# EAGLE design 25062016wearable_v1.2 - routed 99% (EAGLE 7.6.0)
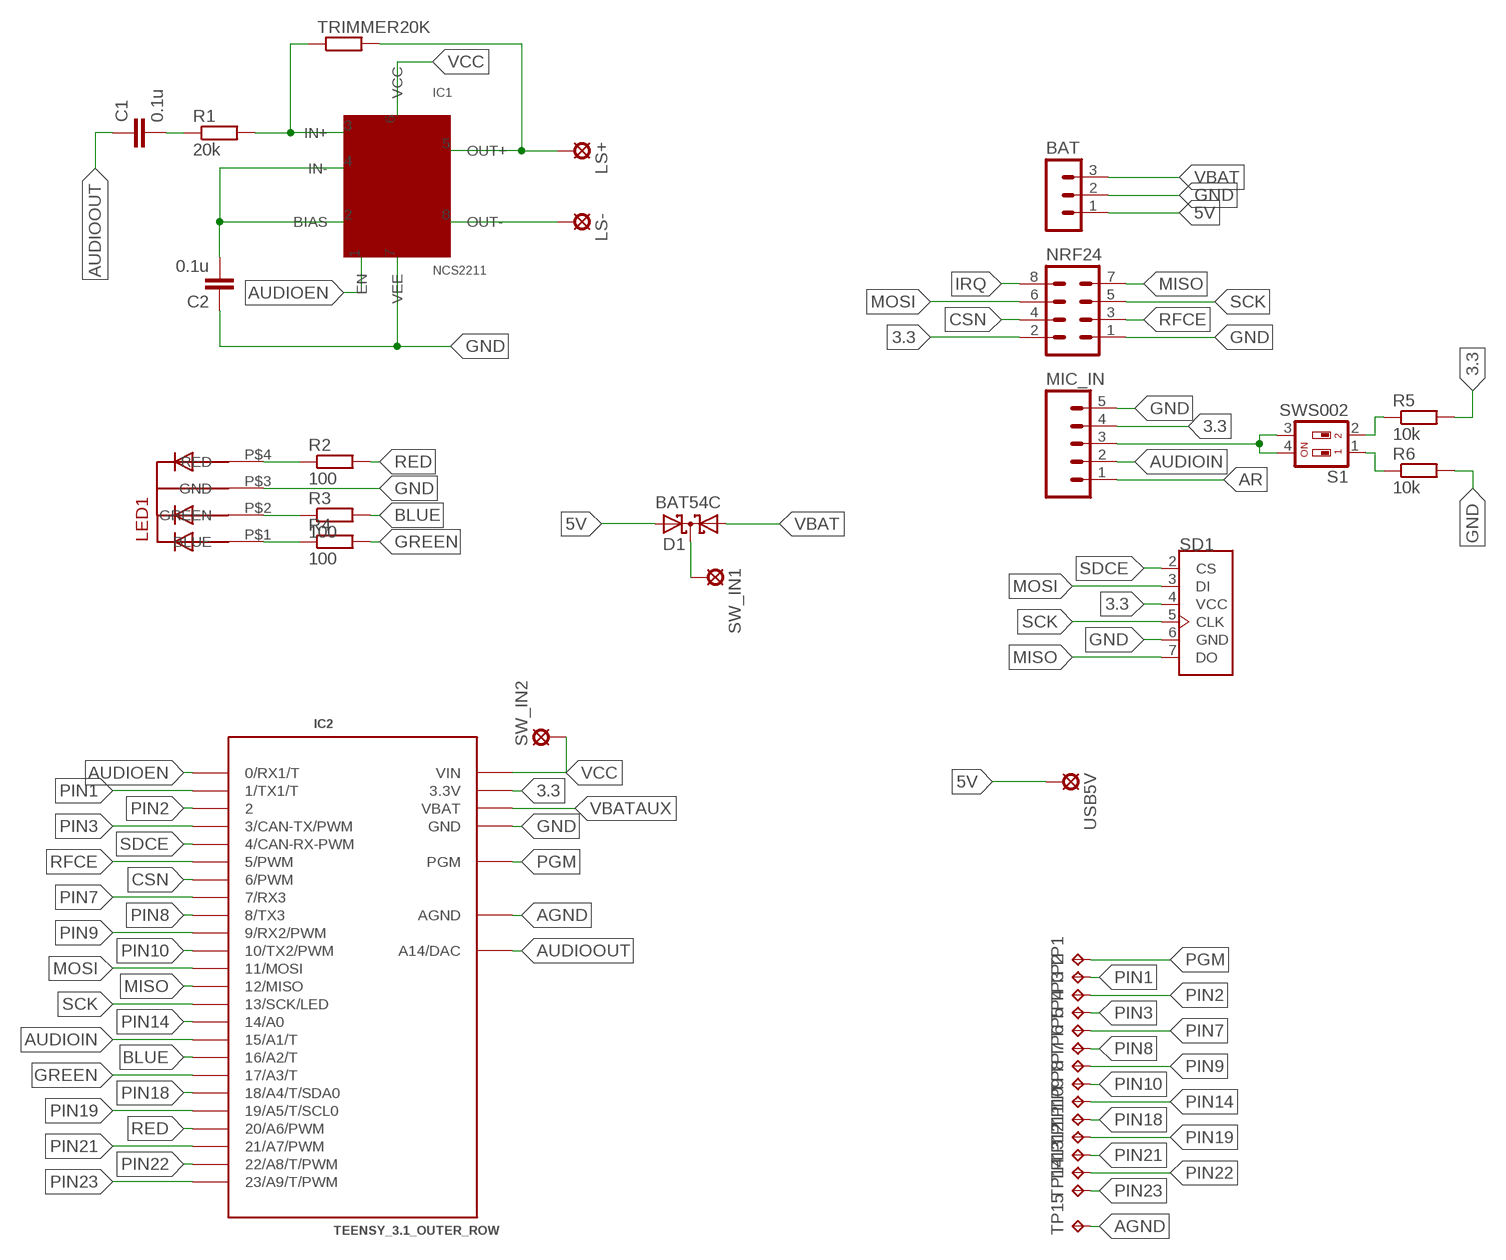
[diagram p0: schematic, sheet 1]

## Parts
BAT  MA03-1  [MA03-1]
C1  0.1u  C2.5/2  [C2.5-2]
C2  0.1u  C2.5/2  [C2.5-2]
D1  BAT54C  [SOT23]
IC1  NCS2211  [SOIC-8]
IC2  TEENSY_3.1_OUTER_ROW  [TEENSY3-OUTER_ROW]
LED1  5MMRGBLED  [LED5MMRGB]
LS+  LSP10  [LSP10]
LS-  LSP10  [LSP10]
MIC_IN  MA05  [05PA]
NRF24  MA04-2  [MA04-2]
R1  20k  R-EU_0204/7  [0204/7]
R2  100  R-EU_0207/2V  [0207/2V]
R3  100  R-EU_0207/2V  [0207/2V]
R4  100  R-EU_0207/2V  [0207/2V]
R5  10k  R-EU_0207/2V  [0207/2V]
R6  10k  R-EU_0207/2V  [0207/2V]
S1  SWS002  [SMS-002]
SD1  MICROSD_SF-MICROSD  [MICROSD_MICROSD]
SW_IN1  SE11  [SE11]
SW_IN2  SE11  [SE11]
TP1  TPPAD1-13  [P1-13]
TP2  TPPAD1-13  [P1-13]
TP3  TPPAD1-13  [P1-13]
TP4  TPPAD1-13  [P1-13]
TP5  TPPAD1-13  [P1-13]
TP6  TPPAD1-13  [P1-13]
TP7  TPPAD1-13  [P1-13]
TP8  TPPAD1-13  [P1-13]
TP9  TPPAD1-13  [P1-13]
TP10  TPPAD1-13  [P1-13]
TP11  TPPAD1-13  [P1-13]
TP12  TPPAD1-13  [P1-13]
TP13  TPPAD1-13  [P1-13]
TP14  TPPAD1-13  [P1-13]
TP15  TPPAD1-13  [P1-13]
TRIMMER20K  R-EU_0207/2V  [0207/2V]
USB5V  LSP10  [LSP10]

## Nets
3.3 [3.3]: IC2.3.3V IC2.3.3V1(3.3V) MIC_IN.4 NRF24.2 R5.2 SD1.4(VCC)
5V [3.3]: BAT.1 D1.2(A2) USB5V.MP
AGND: IC2.AGND TP15.TP
AR: MIC_IN.1
AUDIOEN: IC1.1(EN) IC2.0(0/RX1/T)
AUDIOIN: IC2.15/A1(15/A1/T) MIC_IN.2
AUDIOOUT: C1.1 IC2.RESET/DAC(A14/DAC)
BLUE: IC2.16/A2(16/A2/T) R3.2
CSN: IC2.6(6/PWM) NRF24.4
GAIN: MIC_IN.3 S1.3 S1.4
GND [GND]: BAT.2 C2.1 IC1.7(VEE) IC2.GND IC2.GND1(GND) LED1.P$3(GND) MIC_IN.5 NRF24.1 R6.2 SD1.6(GND)
GREEN: IC2.17/A3(17/A3/T) R4.2
IRQ: NRF24.8
MISO: IC2.12(12/MISO) NRF24.7 SD1.7(DO)
MOSI: IC2.11(11/MOSI) NRF24.6 SD1.3(DI)
N$1: D1.3(CC) SW_IN1.MP
N$2: IC1.5(OUT+) LS+.MP TRIMMER20K.2
N$3: IC1.3(IN+) R1.2 TRIMMER20K.1
N$4: C1.2 R1.1
N$5: C2.2 IC1.2(BIAS) IC1.4(IN-)
N$6: IC1.8(OUT-) LS-.MP
N$7: LED1.P$4(RED) R2.1
N$8: LED1.P$1(BLUE) R4.1
N$9: LED1.P$2(GREEN) R3.1
N$11: R5.1 S1.2
N$12: R6.1 S1.1
PGM: IC2.PGM TP1.TP
PIN1: IC2.1(1/TX1/T) TP2.TP
PIN2: IC2.2 TP3.TP
PIN3: IC2.3(3/CAN-TX/PWM) TP4.TP
PIN7: IC2.7(7/RX3) TP5.TP
PIN8: IC2.8(8/TX3) TP6.TP
PIN9: IC2.9(9/RX2/PWM) TP7.TP
PIN10: IC2.10(10/TX2/PWM) TP8.TP
PIN14: IC2.14/A0 TP9.TP
PIN18: IC2.18/A4(18/A4/T/SDA0) TP10.TP
PIN19: IC2.19/A5(19/A5/T/SCL0) TP11.TP
PIN21: IC2.21/A7(21/A7/PWM) TP12.TP
PIN22: IC2.22/A8(22/A8/T/PWM) TP13.TP
PIN23: IC2.23/A9(23/A9/T/PWM) TP14.TP
RED: IC2.20/A6(20/A6/PWM) R2.2
RFCE: IC2.5(5/PWM) NRF24.3
SCK: IC2.13(13/SCK/LED) NRF24.5 SD1.5(CLK)
SDCE: IC2.4(4/CAN-RX-PWM) SD1.2(CS)
VBAT [3.3]: BAT.3 D1.1(A1)
VBATAUX: IC2.VBAT
VCC: IC1.6(VCC) IC2.VIN SW_IN2.MP

## Library data of the parts
BAT = con-lstb:MA03-1: PIN HEADER; OC_FARNELL: unknown; OC_NEWARK: unknown
C1 C2 = capacitor-wima:C: CAPACITOR naming: grid - package width
D1 = diode:BAT54C: Schottky Diodes Source: Fairchild .. BAT54.pdf
IC1 = NCS2211:NCS2211
IC2 = Teensy_3_and_LC_Series_Boards_v1.1:TEENSY_3.1_OUTER_ROW: Footprint for Teensy 3.1 or 3.2 board using all pin connections on the outer perimeter
LED1 = led_rgb:5MMRGBLED
LS+ LS- USB5V = solpad:LSP10: SOLDER PAD drill 1.0 mm, distributor Buerklin, 12H555
MIC_IN = con-amp-quick:MA05: AMP QUICK CONNECTOR; OC_FARNELL: unknown; OC_NEWARK: unknown
NRF24 = con-lstb:MA04-2: PIN HEADER; OC_FARNELL: unknown; OC_NEWARK: unknown
R1-R6 TRIMMER20K = rcl:R-EU_: RESISTOR, European symbol
S1 = smd-special:SWS002: SMD Dip Switch 2 pol.
SD1 = sd:MICROSD_SF-MICROSD
SW_IN1 SW_IN2 = solpad:SE11: SOLDER PAD RTM, drill 1,1mm, distributor Buerklin, 07F810
TP1-TP15 = testpad:TP: Test pad

## Net classes
0 default: width 0.406 mm
1 GND: width 0.61 mm
2 3.3: width 0.61 mm

## Board
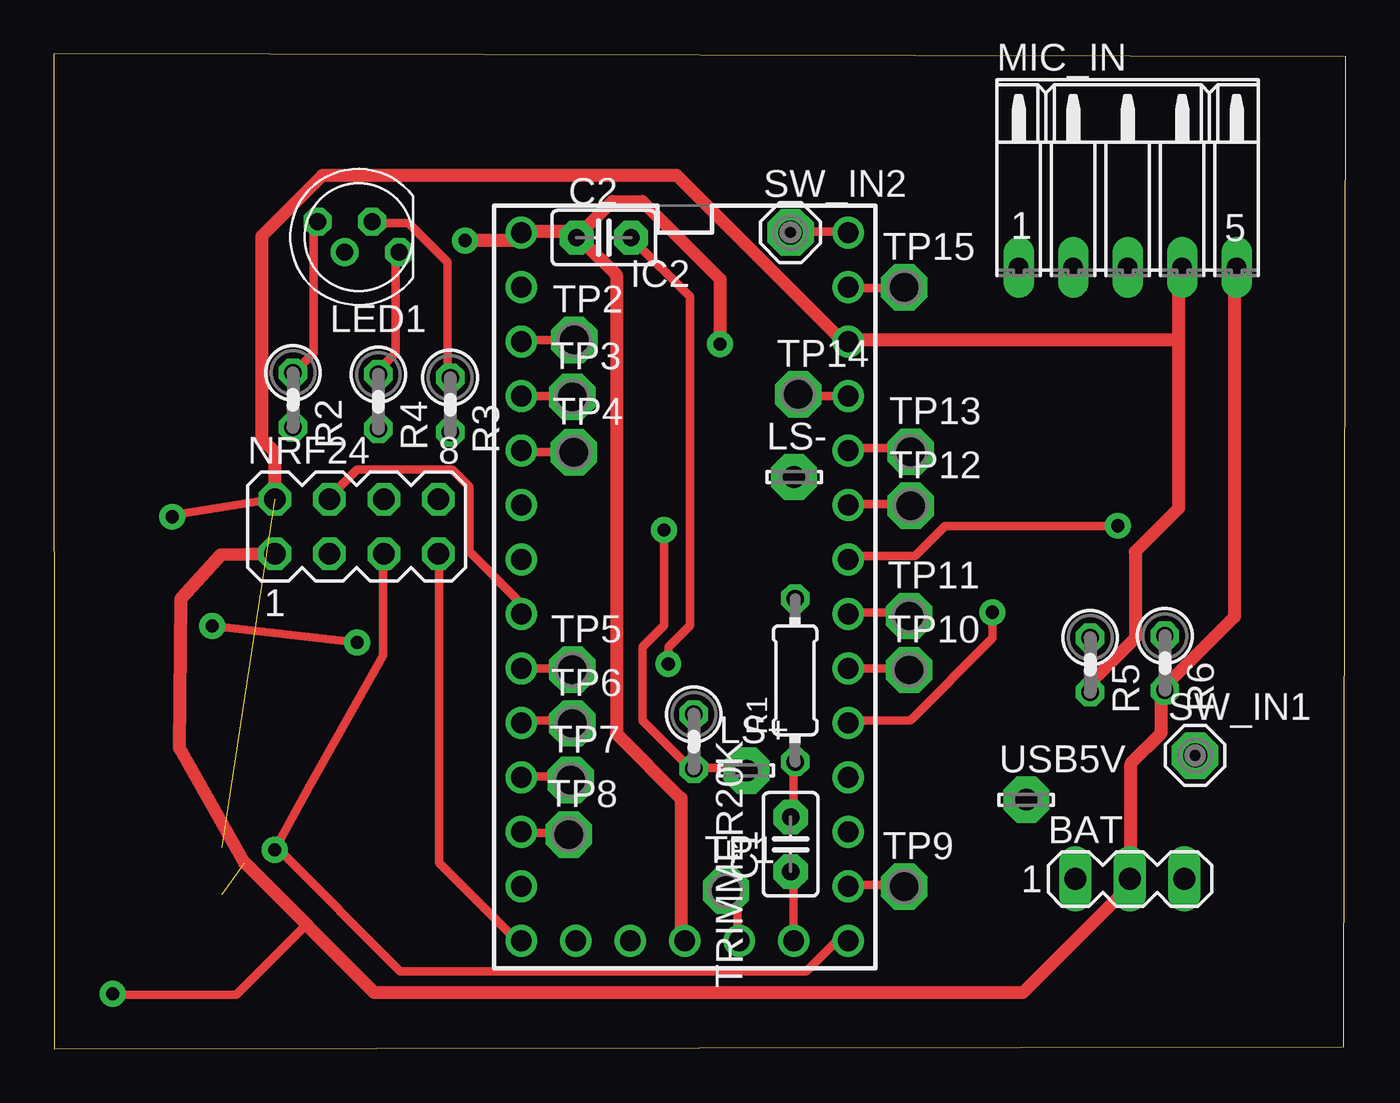
[diagram p1: board, top side]
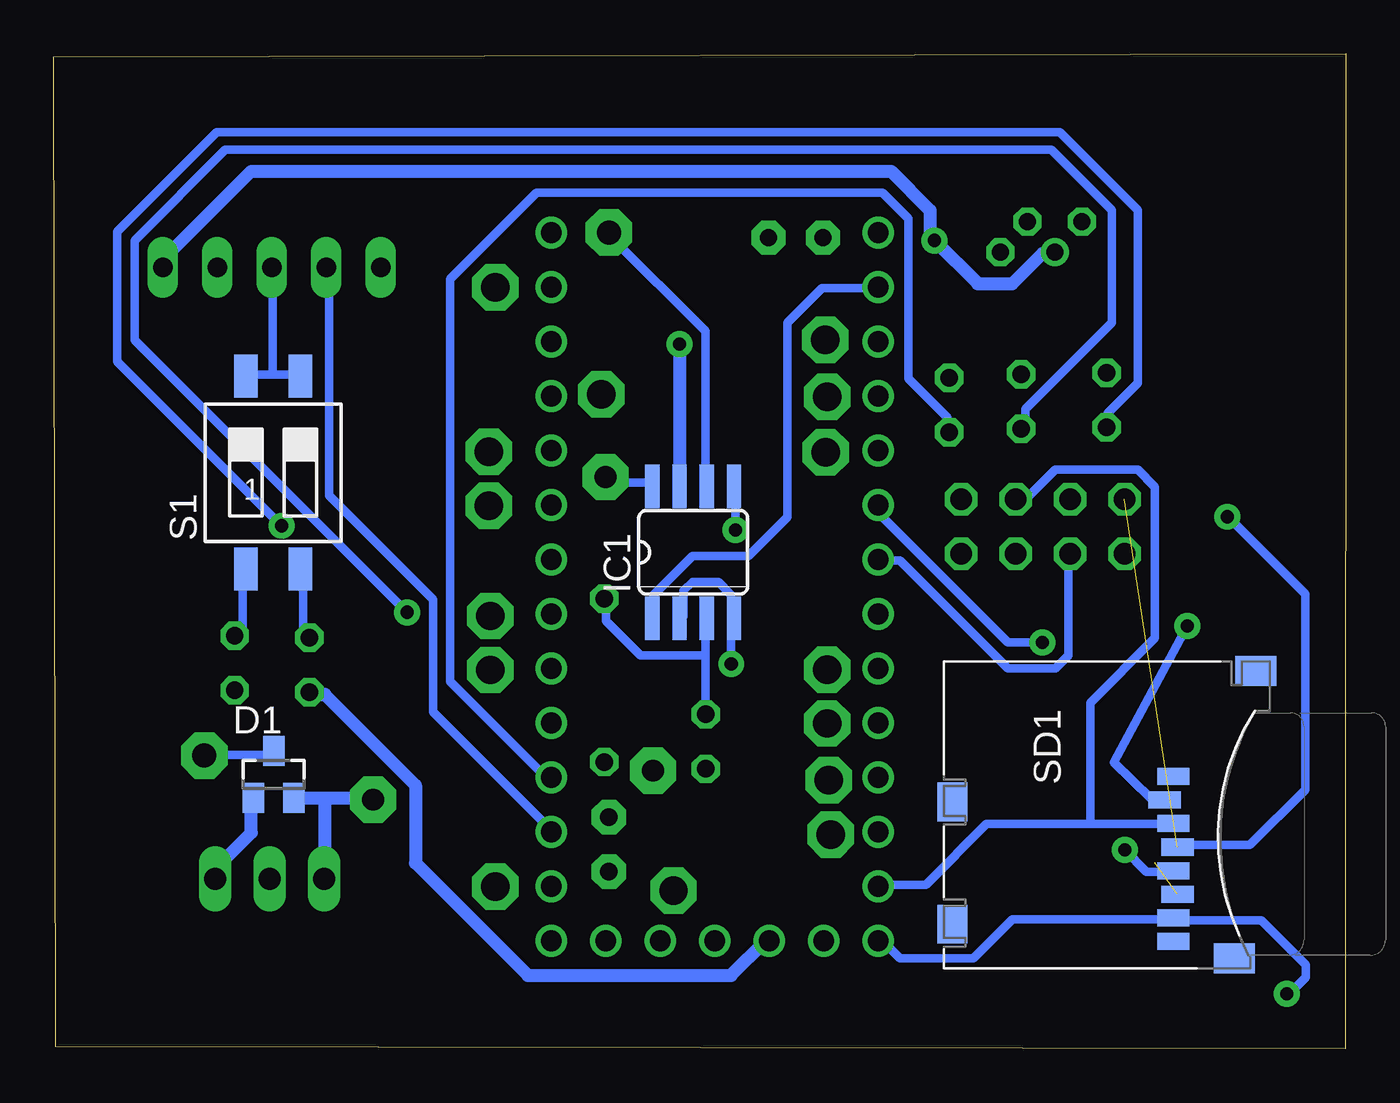
[diagram p2: board, bottom side, seen from below]

Size 60.25 x 46.41 mm. Coordinates in mm from the lower left corner, seen from the top.
Outline: 0.03,0 60.16,0.1 60.25,46.26 0,46.41 0.03,0
Copper layers (1*16): Top 0.035mm / dielectric 1.5mm / Bottom 0.035mm
Design rules "default *": minimum track width 10mil, minimum drill 24mil, track to track 0.4mm, track to pad 0.4mm, pad to pad 0.4mm, via to via 0.4mm, smd to smd 0.4mm, copper to edge 40mil, drill to drill 8mil, minimum pad ring 10mil, minimum via ring 0.3mm, stop-mask expansion 4mil, vias tented up to drill 0mil, thermal gap 10mil

### Footprints (pad centres in the part's own frame; a part is rotated, then mirrored left to right if it is on the bottom)
MA03-1 = drill 1.016 long: 1 -2.54,0; 2 0,0; 3 2.54,0
C2.5-2 = drill 0.813 pad 1.6 octagon: 1 -1.27,0; 2 1.27,0
SOT23 = smd 1 x 1.4: 1 -0.95,-1.1; 2 0.95,-1.1; 3 0,1.1
SOIC-8 = smd 0.66 x 2.032: 1 -1.905,-3.073; 2 -0.635,-3.073; 3 0.635,-3.073; 4 1.905,-3.073; 5 1.905,3.073; 6 0.635,3.073; 7 -0.635,3.073; 8 -1.905,3.073
TEENSY3-OUTER_ROW = drill 0.965: 0 -7.62,13.97; 1 -7.62,11.43; 2 -7.62,8.89; 3 -7.62,6.35; 3.3V 7.62,11.43; 3.3V1 -2.54,-16.51; 4 -7.62,3.81; 5 -7.62,1.27; 6 -7.62,-1.27; 7 -7.62,-3.81; 8 -7.62,-6.35; 9 -7.62,-8.89; 10 -7.62,-11.43; 11 -7.62,-13.97; 12 -7.62,-16.51; 13 7.62,-16.51; 14/A0 7.62,-13.97; 15/A1 7.62,-11.43; 16/A2 7.62,-8.89; 17/A3 7.62,-6.35; 18/A4 7.62,-3.81; 19/A5 7.62,-1.27; 20/A6 7.62,1.27; 21/A7 7.62,3.81; 22/A8 7.62,6.35; 23/A9 7.62,8.89; AGND 7.62,13.97; GND -7.62,16.51; GND1 0,-16.51; PGM 2.54,-16.51; RESET/DAC 5.08,-16.51; VBAT -5.08,-16.51; VIN 7.62,16.51
LED5MMRGB = drill 0.8 pad 0.813 octagon: P$1 -1.905,0.714; P$2 -0.635,-0.714; P$4 1.905,-0.714 | drill 0.8 pad 0.813: P$3 0.635,0.714
LSP10 = drill 1.016 pad 2.159 octagon: MP 0,0
05PA = drill 0.914 long: 1 -5.08,0; 2 -2.54,0; 3 0,0; 4 2.54,0; 5 5.08,0
MA04-2 = drill 1.016 octagon: 1 -3.81,-1.27; 2 -3.81,1.27; 3 -1.27,-1.27; 4 -1.27,1.27; 5 1.27,-1.27; 6 1.27,1.27; 7 3.81,-1.27; 8 3.81,1.27
0204/7 = drill 0.813 octagon: 1 -3.81,0; 2 3.81,0
0207/2V = drill 0.813 octagon: 1 -1.27,0; 2 1.27,0
SMS-002 = smd 1.092 x 2.007: 1 -1.27,-4.496; 2 1.27,-4.496; 3 1.27,4.496; 4 -1.27,4.496
MICROSD_MICROSD = smd 0.8 x 1.5: 1 -1.94,2.7; 2 -0.84,2.3; 3 0.26,2.7; 4 1.36,2.9; 5 2.46,2.7; 6 3.56,2.9; 7 4.66,2.7; 8 5.76,2.7 | smd 1.4 x 1.9: NC -6.85,6.55; NC3 6.55,5.55 | smd 1.8 x 1.4: NC1 -0.75,-7.6; NC2 4.95,-7.6
SE11 = drill 1.118 pad 2.159 octagon: MP 0,0
P1-13 = drill 1.321 pad 2.159 octagon: TP 0,0

### Placement (x,y rotation side)
BAT  50.18,7.93 0 top
C1  34.36,9.54 90 top
C2  25.65,37.83 0 top
D1  49.99,12.8 0 bottom
IC1  30.43,23.16 0 bottom
IC2  29.42,21.55 0 top
LED1  14.21,37.86 180 top
LS+  32.3,12.98 0 top
LS-  34.52,26.67 0 top
MIC_IN  50.08,36.44 0 top
NRF24  14.13,24.36 0 top
R1  34.57,17.19 90 top
R2  11.16,30.26 270 top
R3  18.49,30.03 270 top
R4  15.14,30.18 270 top
R5  48.33,17.91 270 top
R6  51.81,17.99 270 top
S1  50.02,26.87 0 bottom
SD1  10.75,10.77 270 bottom
SW_IN1  53.22,13.68 0 top
SW_IN2  34.36,38.07 0 top
TP1  31.35,7.38 0 top
TP2  24.27,33.06 0 top
TP3  24.18,30.41 0 top
TP4  24.26,27.82 0 top
TP5  24.19,17.68 0 top
TP6  24.19,15.18 0 top
TP7  24.11,12.53 0 top
TP8  24.02,10 0 top
TP9  39.66,7.57 0 top
TP10  39.89,17.67 0 top
TP11  39.89,20.19 0 top
TP12  39.96,25.33 0 top
TP13  39.96,27.85 0 top
TP14  34.72,30.52 0 top
TP15  39.66,35.51 0 top
TRIMMER20K  29.85,14.33 270 top
USB5V  45.35,11.62 0 top

### Tracks (layer width: path | path; a pad name or v marks a point on that pad's centre or on a via)
3.3  (1 unrouted)
  Top 0.61: 52.45,33.06 52.45,36.29 MIC_IN.4 | 52.45,33.06 52.45,25.2 50.43,23.18 50.43,19.15 48.41,17.14 48.41,16.73 R5.2 | 52.45,33.06 37.12,33.06 IC2.3.3V 36.92,32.86 29.06,40.72 12.53,40.72 9.71,37.9 9.71,28.43 10.31,27.82 10.31,25.8 NRF24.2
  Bottom 0.61: IC2.3.3V1 27.04,5.04 28.66,3.43 38.13,3.43 43.37,8.67 43.37,12.3 47.61,16.53 48.21,16.53 R5.2
5V
  Bottom 0.61: 47.61,11.69 45.39,11.69 USB5V.MP | 47.61,11.69 49.02,11.69 D1.2 | 47.61,11.69 47.61,8.06 BAT.1
AGND
  Top 0.406: IC2.AGND 37.12,35.48 39.54,35.48 TP15.TP
AUDIOEN
  Bottom 0.406: IC1.1 32.29,20.16 32.29,21.17 30.47,22.98 27.85,22.98 26.04,24.8 26.04,33.87 24.42,35.48 21.8,35.48 IC2.0
AUDIOIN
  Bottom 0.406: MIC_IN.2 47.41,36.29 47.41,25.8 42.57,20.97 42.57,15.72 37.12,10.28 IC2.15/A1
AUDIOOUT
  Top 0.406: IC2.RESET/DAC 34.5,8.27 C1.1
BLUE
  Bottom 0.406: R3.2 18.58,28.83 18.58,29.43 20.39,31.25 20.39,38.71 21.6,39.92 37.73,39.92 41.76,35.88 41.76,17.14 37.12,12.5 IC2.16/A2
CSN
  Top 0.406: IC2.6 21.6,20.36 21.6,20.97 19.38,23.18 19.38,26.21 18.58,27.01 14.14,27.01 12.93,25.8 NRF24.4
GAIN
  Bottom 0.406: 50.03,31.45 51.24,31.45 S1.4 | 50.03,31.45 48.82,31.45 S1.3 | 50.03,31.45 50.03,36.29 MIC_IN.3
GND  (via drill 0.61)  (1 unrouted)
  Top 0.61: v19.18,37.7 21.4,37.7 21.6,37.9 IC2.GND 22,38.1 24.22,38.1 C2.1 | v31.08,32.86 31.08,35.88 27.45,39.51 26.04,39.51 24.42,37.9 C2.1 | IC2.GND1 29.26,5.04 29.26,11.69 26.24,14.72 26.24,36.09 24.62,37.7 C2.1 | MIC_IN.5 55.07,36.29 55.07,20.16 51.84,16.93 R6.2 51.64,16.53 51.64,14.72 50.23,13.31 50.23,8.06 BAT.2 50.23,7.66 45.19,2.62 14.95,2.62 8.9,8.67 5.87,14.03 5.94,21 7.8,23.05 NRF24.1
  Bottom 0.61: LED1.P$3 13.74,37.09 14.14,37.09 15.55,35.68 17.17,35.68 v19.18,37.7 19.38,37.9 19.38,39.11 21.2,40.92 51.04,40.92 55.07,36.89 55.07,36.49 MIC_IN.5 | v31.08,32.86 31.08,26.41 IC1.7
GREEN  (via drill 0.61)
  Top 0.406: v43.78,20.36 43.78,19.15 39.95,15.32 37.12,15.32 IC2.17/A3
  Bottom 0.406: v43.78,20.36 56.48,33.06 56.48,37.7 52.24,41.93 13.74,41.93 10.92,39.11 10.92,33.87 14.95,29.84 14.95,29.03 R4.2
MISO
  Top 0.406: NRF24.7 17.97,22.98 17.97,8.67 21.6,5.04 IC2.12
  Bottom 0.406: SD1.7 8.09,6.05 15.55,6.05 17.37,4.23 20.8,4.23 21.6,5.04 IC2.12
MOSI
  Bottom 0.406: 11.92,10.48 16.76,10.48 19.59,7.66 21.6,7.66 IC2.11 | 11.92,10.48 8.09,10.48 SD1.3 | 11.92,10.48 11.92,16.13 8.9,19.15 8.9,26.21 9.71,27.01 13.54,27.01 14.75,25.8 15.35,25.8 NRF24.6
N$1
  Bottom 0.406: D1.3 50.03,13.71 53.05,13.71 SW_IN1.MP
N$2  (via drill 0.61)
  Top 0.406: v28.46,24.19 28.46,19.76 27.45,18.75 27.45,15.32 29.67,13.1 TRIMMER20K.2 29.87,13.1 32.29,13.1 LS+.MP
  Bottom 0.406: v28.46,24.19 28.46,26.21 IC1.5
N$3
  Bottom 0.406: 29.87,18.35 29.87,15.72 TRIMMER20K.1 | 29.87,18.35 29.87,19.96 IC1.3 | 29.87,18.35 32.89,18.35 34.5,19.96 34.5,20.97 R1.2
N$4
  Top 0.406: R1.1 34.5,13.31 34.5,10.89 C1.2
N$5  (via drill 0.61)
  Top 0.406: v28.66,17.94 28.66,18.75 29.67,19.76 29.67,35.08 27.04,37.7 C2.2
  Bottom 0.406: IC1.2 30.88,20.16 30.88,21.37 30.47,21.77 29.26,21.77 28.66,21.17 28.66,20.16 IC1.4 28.66,19.96 v28.66,17.94
N$6
  Bottom 0.406: IC1.8 32.49,26.41 34.3,26.41 34.5,26.61 LS-.MP
N$7
  Top 0.406: LED1.P$4 12.13,38.51 12.13,32.46 11.32,31.65 R2.1
N$8
  Top 0.406: LED1.P$1 15.96,37.09 15.96,32.46 15.15,31.65 R4.1
N$9
  Top 0.406: LED1.P$2 14.95,38.51 16.56,38.51 18.38,36.69 18.38,31.45 R3.1
N$10
  Top 0.406: 5.57,24.89 10.24,25.65
  Bottom 0.406: 7.56,9.52 4.47,9.52 1.9,12.09 1.9,21.22 5.57,24.89
N$11
  Bottom 0.406: S1.2 48.62,22.18 48.62,19.55 48.41,19.35 R5.1
N$12
  Bottom 0.406: S1.1 51.44,22.18 51.44,19.55 51.64,19.35 R6.1
N$13
  Top 0.406: 11.75,5.76 8.51,2.52 2.76,2.52
N$14
  Bottom 0.406: 7.86,5.99 3.94,5.99 1.87,3.92 1.87,3.35 2.71,2.51
PGM
  Top 0.406: IC2.PGM 31.88,5.04 31.88,6.85 31.48,7.26 TP1.TP
PIN1
  Top 0.406: IC2.1 21.8,33.06 24.22,33.06 TP2.TP
PIN2
  Top 0.406: IC2.2 24.02,30.44 TP3.TP
PIN3
  Top 0.406: IC2.3 21.8,27.82 24.22,27.82 TP4.TP
PIN7
  Top 0.406: IC2.7 24.02,17.74 TP5.TP
PIN8
  Top 0.406: IC2.8 21.8,15.32 24.02,15.32 TP6.TP
PIN9
  Top 0.406: IC2.9 21.8,12.7 24.02,12.7 TP7.TP
PIN10
  Top 0.406: IC2.10 21.8,10.08 23.82,10.08 TP8.TP
PIN14
  Top 0.406: IC2.14/A0 37.12,7.66 39.54,7.66 TP9.TP
PIN18
  Top 0.406: IC2.18/A4 37.12,17.74 39.75,17.74 TP10.TP
PIN19
  Top 0.406: IC2.19/A5 37.12,20.36 39.75,20.36 TP11.TP
PIN21
  Top 0.406: IC2.21/A7 37.12,25.4 39.95,25.4 TP12.TP
PIN22
  Top 0.406: IC2.22/A8 37.12,28.02 39.95,28.02 TP13.TP
PIN23
  Top 0.406: IC2.23/A9 36.92,30.44 34.91,30.44 TP14.TP
RED  (via drill 0.61)
  Top 0.406: v49.62,24.39 41.56,24.39 40.15,22.98 37.12,22.98 IC2.20/A6
  Bottom 0.406: v49.62,24.39 57.28,32.05 57.28,38.1 52.65,42.74 13.34,42.74 9.71,39.11 9.71,31.05 11.12,29.64 11.12,29.03 R2.2
RFCE
  Bottom 0.406: IC2.5 21.6,22.78 20.8,22.78 15.75,17.74 13.54,17.74 12.93,18.35 12.93,22.98 NRF24.3
SCK  (via drill 0.61)
  Top 0.406: NRF24.5 15.35,22.98 15.35,18.35 11.94,12.26 v10.31,9.27 10.51,9.27 16.16,3.63 35.11,3.63 36.52,5.04 IC2.13
  Bottom 0.406: v10.31,9.27 9.3,8.27 8.09,8.27 SD1.5
  other vias: 2.75,2.56
SDCE  (via drill 0.61)
  Top 0.406: v14.14,18.95 v7.4,19.72
  Bottom 0.406: v7.4,19.72 10.82,13.36 9.1,11.69 8.5,11.69 SD1.2 | v14.14,18.95 15.75,18.95 21.6,24.8 21.6,25.2 IC2.4
  other vias: 5.52,24.81
VBAT
  Bottom 0.61: D1.1 51.04,11.69 51.04,10.08 52.65,8.47 52.65,8.06 BAT.3
VCC
  Top 0.406: IC2.VIN 36.92,38.1 34.5,38.1 SW_IN2.MP
  Bottom 0.406: IC1.6 29.87,26.41 29.87,33.47 34.3,37.9 SW_IN2.MP